# Altium schematic sheet Wi-Fi.SchDoc
size B; SheetNumber: 5; SheetTotal: 5
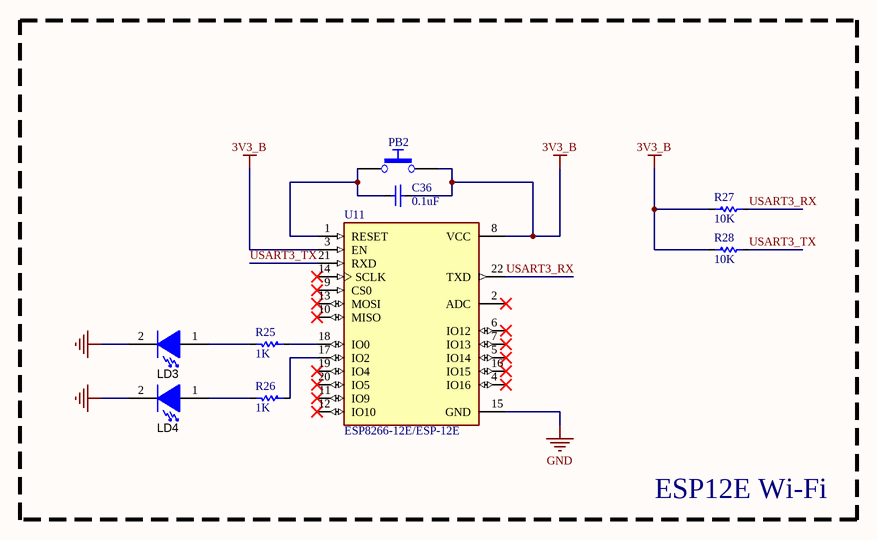
[diagram p0: Wi-Fi.SchDoc]

## Parts
C36  0.1uF  [CAPC1608-0603X85N]
LD3  160-1183-1-ND  [LED_LTST-C190]  (value not drawn)
LD4  160-1183-1-ND  [LED_LTST-C190]  (value not drawn)
PB2  Push Button  [PB_TYCO_FSMSM]  (value not drawn)
R25  1K  [RESC1608-0603X50N]
R26  1K  [RESC1608-0603X50N]
R27  10K  [RESC1608-0603X50N]
R28  10K  [RESC1608-0603X50N]
U11  ESP8266-12E/ESP-12E  [XCVR_ESP8266-12E/ESP-12E]

## Blocks framed on the sheet
ESP12E Wi-Fi: C36 LD3 LD4 PB2 R25-R28 U11

## Nets
3V3_B: C36.2 PB2.2 R27.1 R28.1 U11.3(EN) U11.8(VCC)
GND: LD3.2(K) LD4.2(K) U11.15(GND)
USART3_RX: R27.2 U11.22(TXD)
USART3_TX: R28.2 U11.21(RXD)
NetC36_1: C36.1 PB2.1 U11.1(RESET)
NetLD3_1: LD3.1(A) R25.2
NetLD4_1: LD4.1(A) R26.2
NetR25_1: R25.1 U11.18(IO0)
NetR26_1: R26.1 U11.17(IO2)

Not connected (* = marked no-connect by the designer): U11 2(ADC)* 4(IO16)* 5(IO14)* 6(IO12)* 7(IO13)* 9(CS0)* 10(MISO)* 11(IO9)* 12(IO10)* 13(MOSI)* 14(SCLK)* 16(IO15)* 19(IO4)* 20(IO5)*

## Library data of the parts
C36 = Capacitor Ceramic: CAP CER 0.1UF 25V X7R 0603; MANUFACTURER PN: CC0603KRX7R8BB104; MANUFACTURER: Yageo; POPULATED: YES; TOLERANCE: ±10%; VOLTAGE: 25V; PACKAGE: 0603; DIGIKEY PN: 1276-1000-2-ND(STOK)
LD3 LD4 = LTST-C190GKT: LED, Green, SMD; DIGIKEY PN: 160-1183-1-ND
PB2 = PB_TYCO_FSMSM: Push-Button Switch SPDT; Part Description: 12VDC 50mA SPST Tactile  Push-Button Switch; Manufacturer: TYCO ELECTRONICS; Manufacturer Part Number: FSMSM or 1437566-3; Table: Switches; POPULATED: YES; Part Number: PB_TYCO_FSMSM; Component Kind: Standard; Component Type: Standard; Pin Count: 2; PackageDescription: Body 3.5x6.0mm, Pushbutton Switch,  TYCO ALCOSWITCH FSMSM Serie; Family: Push Button; Mounted: Yes; Socket: No; SMD: Yes; Status: None; ComponentHeight: 4.3mm; HelpURL: \\cern.ch\dfs\Applications\Altium\Datasheets\PB_TYCO_FSMSM.pdf; Author: CERN DEM JLC; CreateDate: 30.6.2008; LatestRevisionDate: 21.6.2012; DIGIKEY PN: 450-1140-ND
R25 R26 = Resistor SMD: RES SMD 1K OHM 1% 1/10W 0603; MANUFACTURER: Panasonic Electronic Components; MANUFACTURER PN: ERJ-3EKF1001V; POPULATED: YES; DIGIKEY PN: 311-1.00KHRTR-ND(STOK); PACKAGE: 0603; TOLERANCE: 1%
R27 R28 = RESISTOR 10K: RES SMD 10K OHM 1% 1/10W 0603; MANUFACTURER: Yageo; MANUFACTURER PN: RC0603FR-0710KL; POPULATED: YES; ANTSIS STOK PN: R10K006030101; ASSEMBLY: Auto; DIGIKEY PN: ANTSIS_STOK; PACKAGE: 0603
U11 = ESP8266-12E/ESP-12E: This WiFi module has a 32-bit MCU micro and clock speeds supporting 80 MHz or 160 MHz. Supports the RTOS and integrated Wi-Fi MAC/BB/RF/PA/LNA, and has an on-board antenna.; MF: AI-Thinker; Price: None; Package: None; Value: *; MP: ESP8266-12E/ESP-12E; Availability: Unavailable; SnapEDA_Link: https://www.snapeda.com/parts/ESP8266-12E/ESP-12E/AI-Thinker/view-part/106414/?ref=snap